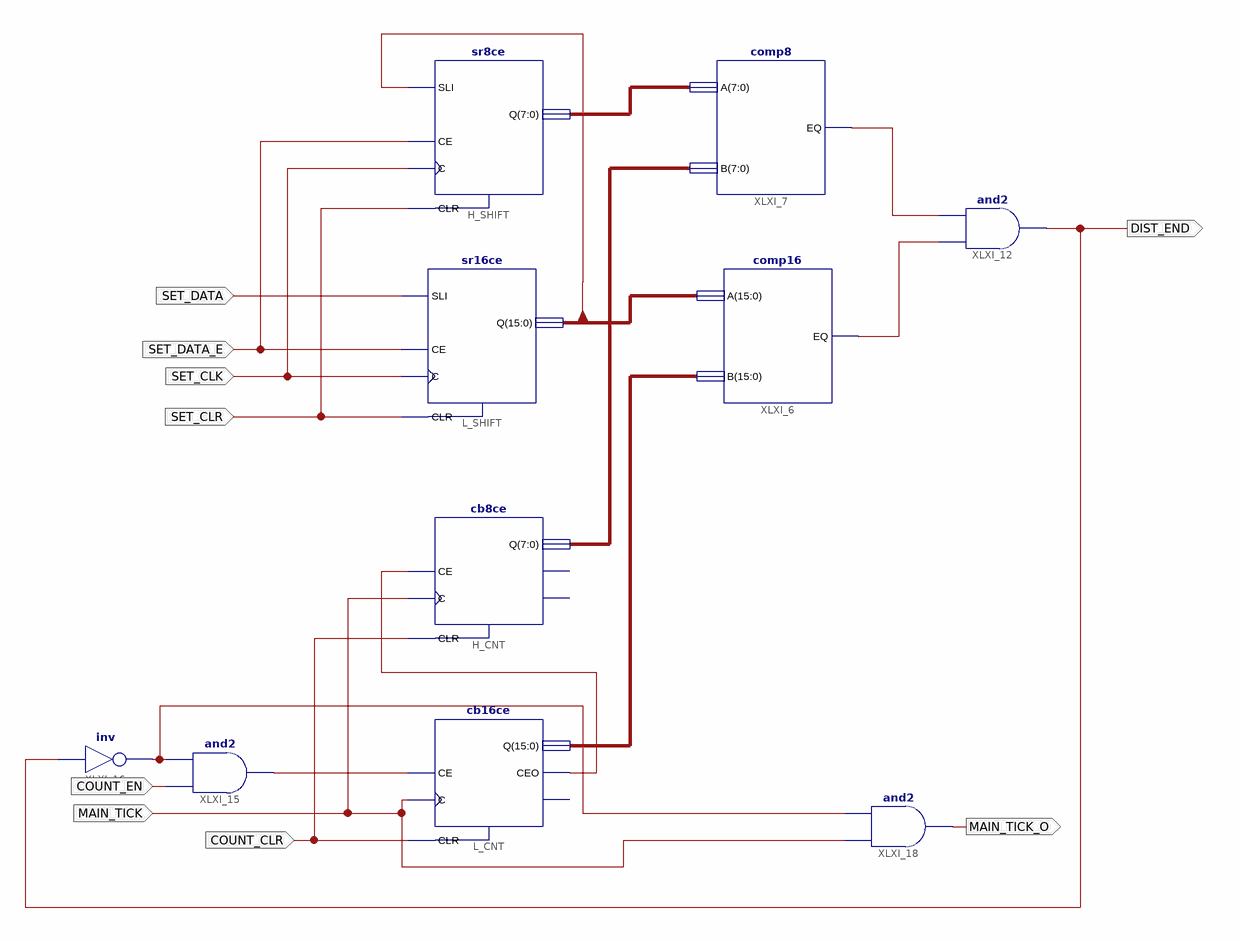
[diagram p0: schematic sheet 1]
// Xilinx ISE schematic distance_module.sch (spartan6) as structural Verilog: 10 symbols, 9 ports
module distance_module (
  input  SET_DATA_E,
  input  SET_CLK,
  input  SET_CLR,
  input  COUNT_CLR,
  input  SET_DATA,
  input  MAIN_TICK,
  input  COUNT_EN,
  output DIST_END,
  output MAIN_TICK_O
);

  wire XLXN_6, XLXN_7, XLXN_8, XLXN_20, XLXN_22;
  wire [7:0] XLXN_1, XLXN_10;
  wire [15:0] XLXN_2, XLXN_11;

  sr16ce L_SHIFT (.C(SET_CLK), .CE(SET_DATA_E), .CLR(SET_CLR), .SLI(SET_DATA), .Q(XLXN_2));
  sr8ce H_SHIFT (.C(SET_CLK), .CE(SET_DATA_E), .CLR(SET_CLR), .SLI(XLXN_2[15]), .Q(XLXN_1));
  comp16 XLXI_6 (.A(XLXN_2), .B(XLXN_11), .EQ(XLXN_7));
  comp8 XLXI_7 (.A(XLXN_1), .B(XLXN_10), .EQ(XLXN_6));
  and XLXI_12 (DIST_END, XLXN_7, XLXN_6);
  cb16ce L_CNT (.C(MAIN_TICK), .CE(XLXN_22), .CLR(COUNT_CLR), .CEO(XLXN_8), .Q(XLXN_11));  // open: TC
  cb8ce H_CNT (.C(MAIN_TICK), .CE(XLXN_8), .CLR(COUNT_CLR), .Q(XLXN_10));  // open: CEO, TC
  and XLXI_15 (XLXN_22, COUNT_EN, XLXN_20);
  not XLXI_16 (XLXN_20, DIST_END);
  and XLXI_18 (MAIN_TICK_O, MAIN_TICK, XLXN_20);
endmodule
